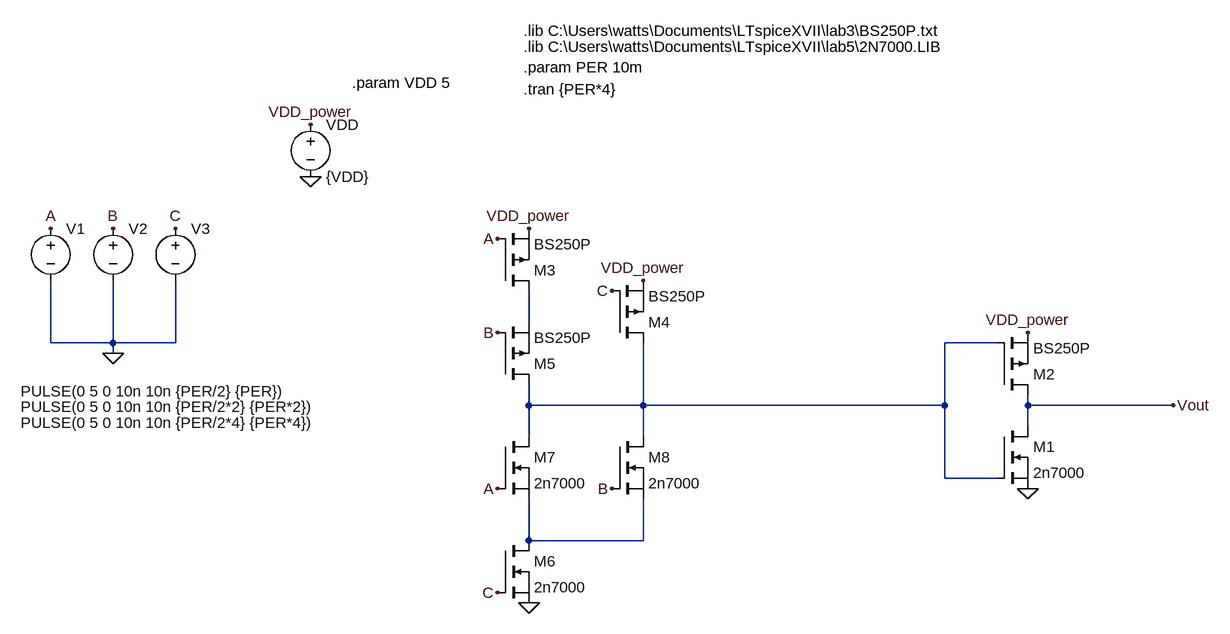
[diagram p0: schematic CMOS_A_or_B_AND_C.asc]
CMOS_A_or_B_AND_C.asc, the LTspice schematic file:
Version 4
SHEET 1 1272 680
WIRE 112 -80 112 -128
WIRE -624 -48 -624 -144
WIRE -528 -48 -528 -144
WIRE -528 -48 -624 -48
WIRE -432 -48 -432 -144
WIRE -432 -48 -528 -48
WIRE 832 -48 752 -48
WIRE -528 -32 -528 -48
WIRE 112 48 112 16
WIRE 288 48 288 -48
WIRE 288 48 112 48
WIRE 752 48 752 -48
WIRE 752 48 288 48
WIRE 880 48 880 32
WIRE 1104 48 880 48
WIRE 880 80 880 48
WIRE 112 96 112 48
WIRE 288 96 288 48
WIRE 752 160 752 48
WIRE 832 160 752 160
WIRE 112 256 112 192
WIRE 288 256 288 192
WIRE 288 256 112 256
FLAG -528 -32 0
FLAG -624 -224 A
FLAG -528 -224 B
FLAG -432 -224 C
FLAG -224 -384 VDD_power
FLAG -224 -304 0
FLAG 1104 48 Vout
FLAG 880 -64 VDD_power
FLAG 880 176 0
FLAG 112 -224 VDD_power
FLAG 288 -144 VDD_power
FLAG 64 -208 A
FLAG 64 176 A
FLAG 64 -64 B
FLAG 240 176 B
FLAG 64 336 C
FLAG 240 -128 C
FLAG 112 352 0
SYMBOL voltage -624 -240 R0
WINDOW 3 -46 266 Left 2
WINDOW 123 0 0 Left 0
WINDOW 39 0 0 Left 0
SYMATTR InstName V1
SYMATTR Value PULSE(0 5 0 10n 10n {PER/2} {PER})
SYMBOL voltage -528 -240 R0
WINDOW 3 -142 290 Left 2
WINDOW 123 0 0 Left 0
WINDOW 39 0 0 Left 0
SYMATTR InstName V2
SYMATTR Value PULSE(0 5 0 10n 10n {PER/2*2} {PER*2})
SYMBOL voltage -432 -240 R0
WINDOW 3 -238 315 Left 2
WINDOW 123 0 0 Left 0
WINDOW 39 0 0 Left 0
SYMATTR InstName V3
SYMATTR Value PULSE(0 5 0 10n 10n {PER/2*4} {PER*4})
SYMBOL voltage -224 -400 R0
WINDOW 123 0 0 Left 0
WINDOW 39 0 0 Left 0
SYMATTR InstName VDD
SYMATTR Value {VDD}
SYMBOL pmos 64 -128 M180
SYMATTR InstName M3
SYMATTR Value BS250P
SYMATTR Prefix X
SYMBOL pmos 240 -48 M180
SYMATTR InstName M4
SYMATTR Value BS250P
SYMATTR Prefix X
SYMBOL pmos 64 16 M180
SYMATTR InstName M5
SYMATTR Value BS250P
SYMATTR Prefix X
SYMBOL nmos 64 96 R0
SYMATTR InstName M7
SYMATTR Value 2n7000
SYMATTR Prefix X
SYMBOL nmos 240 96 R0
SYMATTR InstName M8
SYMATTR Value 2n7000
SYMATTR Prefix X
SYMBOL nmos 832 80 R0
SYMATTR InstName M1
SYMATTR Value 2n7000
SYMATTR Prefix X
SYMBOL pmos 832 32 M180
SYMATTR InstName M2
SYMATTR Value BS250P
SYMATTR Prefix X
SYMBOL nmos 64 256 R0
SYMATTR InstName M6
SYMATTR Value 2n7000
SYMATTR Prefix X
TEXT 104 -504 Left 2 !.lib C:\\Users\\watts\\Documents\\LTspiceXVII\\lab5\\2N7000.LIB
TEXT 104 -528 Left 2 !.lib C:\\Users\\watts\\Documents\\LTspiceXVII\\lab3\\BS250P.txt
TEXT 104 -472 Left 2 !.param PER 10m
TEXT 104 -438 Left 2 !.tran {PER*4}
TEXT -160 -448 Left 2 !.param VDD 5

The netlist it stands for:
* CMOS_A_or_B_AND_C.asc
V1 A 0 PULSE(0 5 0 10n 10n {PER/2} {PER})
V2 B 0 PULSE(0 5 0 10n 10n {PER/2*2} {PER*2})
V3 C 0 PULSE(0 5 0 10n 10n {PER/2*4} {PER*4})
VDD VDD_power 0 {VDD}
XM3 N001 A VDD_power BS250P  ; pins D G S
XM4 N002 C VDD_power BS250P  ; pins D G S
XM5 N002 B N001 BS250P  ; pins D G S
XM7 N002 A N003 2n7000  ; pins D G S
XM8 N002 B N003 2n7000  ; pins D G S
XM1 Vout N002 0 2n7000  ; pins D G S
XM2 Vout N002 VDD_power BS250P  ; pins D G S
XM6 N003 C 0 2n7000  ; pins D G S
.lib C:\Users\watts\Documents\LTspiceXVII\lab5\2N7000.LIB
.lib C:\Users\watts\Documents\LTspiceXVII\lab3\BS250P.txt
.param PER 10m
.tran {PER*4}
.param VDD 5
.backanno
.end